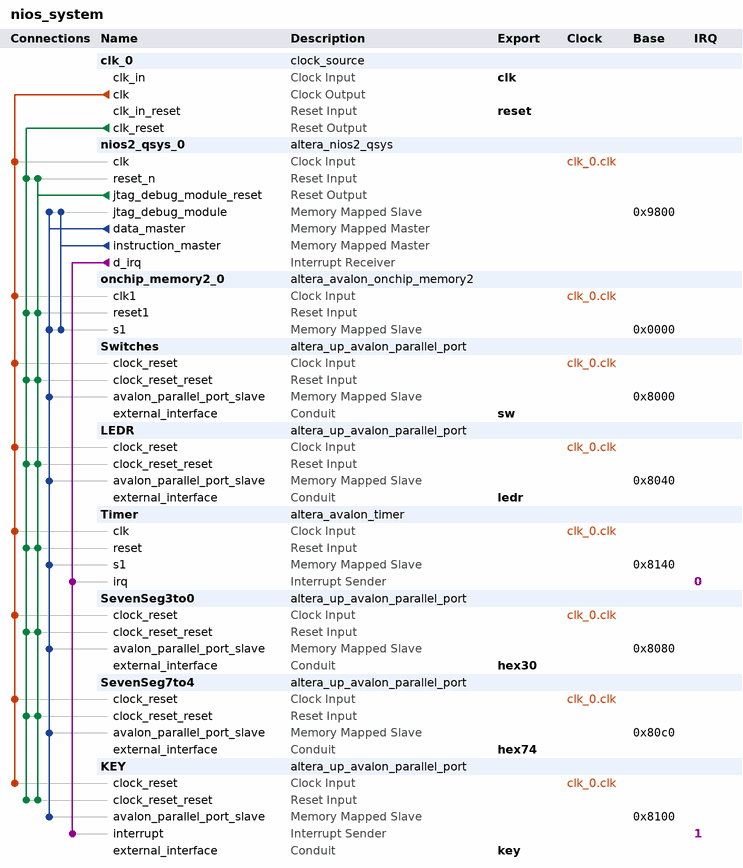
[diagram p0: system contents]
# Platform Designer (Qsys) system nios_system, Cyclone II EP2C35F672C6
# Parameters at their usual value, and those the tool derives, are not listed.
package require -exact qsys 13.0
create_system nios_system
set_project_property DEVICE_FAMILY {Cyclone II}
set_project_property DEVICE EP2C35F672C6

add_instance clk_0 clock_source 13.0
set_instance_parameter_value clk_0 clockFrequency 50000000

add_instance nios2_qsys_0 altera_nios2_qsys 13.0
set_instance_parameter_value nios2_qsys_0 resetSlave onchip_memory2_0.s1
set_instance_parameter_value nios2_qsys_0 mmu_TLBMissExcSlave None
set_instance_parameter_value nios2_qsys_0 exceptionSlave onchip_memory2_0.s1
set_instance_parameter_value nios2_qsys_0 breakSlave nios2_qsys_0.jtag_debug_module
set_instance_parameter_value nios2_qsys_0 impl Small
set_instance_parameter_value nios2_qsys_0 icache_size 4096

add_instance onchip_memory2_0 altera_avalon_onchip_memory2 13.0.1.99.2
set_instance_parameter_value onchip_memory2_0 dataWidth 32
set_instance_parameter_value onchip_memory2_0 dualPort false
set_instance_parameter_value onchip_memory2_0 initMemContent true
set_instance_parameter_value onchip_memory2_0 initializationFileName onchip_mem.hex
set_instance_parameter_value onchip_memory2_0 memorySize 32768

add_instance Switches altera_up_avalon_parallel_port 13.0
set_instance_parameter_value Switches board DE2
set_instance_parameter_value Switches preset {Slider Switches}
set_instance_parameter_value Switches capture false
set_instance_parameter_value Switches edge Rising
set_instance_parameter_value Switches irq false

add_instance LEDR altera_up_avalon_parallel_port 13.0
set_instance_parameter_value LEDR board DE2
set_instance_parameter_value LEDR preset LEDs
set_instance_parameter_value LEDR leds Red
set_instance_parameter_value LEDR capture false
set_instance_parameter_value LEDR edge Rising
set_instance_parameter_value LEDR irq false

add_instance Timer altera_avalon_timer 13.0.1.99.2
set_instance_parameter_value Timer period 1
set_instance_parameter_value Timer periodUnits MSEC

add_instance SevenSeg3to0 altera_up_avalon_parallel_port 13.0
set_instance_parameter_value SevenSeg3to0 board DE2
set_instance_parameter_value SevenSeg3to0 preset {Seven Segment Displays}
set_instance_parameter_value SevenSeg3to0 capture false
set_instance_parameter_value SevenSeg3to0 edge Rising
set_instance_parameter_value SevenSeg3to0 irq false

add_instance SevenSeg7to4 altera_up_avalon_parallel_port 13.0
set_instance_parameter_value SevenSeg7to4 board DE2
set_instance_parameter_value SevenSeg7to4 preset {Seven Segment Displays}
set_instance_parameter_value SevenSeg7to4 sevensegs {7 to 4}
set_instance_parameter_value SevenSeg7to4 capture false
set_instance_parameter_value SevenSeg7to4 edge Rising
set_instance_parameter_value SevenSeg7to4 irq false

add_instance KEY altera_up_avalon_parallel_port 13.0
set_instance_parameter_value KEY board DE2
set_instance_parameter_value KEY preset Pushbuttons
set_instance_parameter_value KEY capture true
set_instance_parameter_value KEY edge Rising
set_instance_parameter_value KEY irq true

# connections
add_connection clk_0.clk KEY.clock_reset clock
add_connection clk_0.clk LEDR.clock_reset clock
add_connection clk_0.clk nios2_qsys_0.clk clock
add_connection clk_0.clk onchip_memory2_0.clk1 clock
add_connection clk_0.clk SevenSeg3to0.clock_reset clock
add_connection clk_0.clk SevenSeg7to4.clock_reset clock
add_connection clk_0.clk Switches.clock_reset clock
add_connection clk_0.clk Timer.clk clock
add_connection clk_0.clk_reset KEY.clock_reset_reset reset
add_connection clk_0.clk_reset LEDR.clock_reset_reset reset
add_connection clk_0.clk_reset nios2_qsys_0.reset_n reset
add_connection clk_0.clk_reset onchip_memory2_0.reset1 reset
add_connection clk_0.clk_reset SevenSeg3to0.clock_reset_reset reset
add_connection clk_0.clk_reset SevenSeg7to4.clock_reset_reset reset
add_connection clk_0.clk_reset Switches.clock_reset_reset reset
add_connection clk_0.clk_reset Timer.reset reset
add_connection nios2_qsys_0.jtag_debug_module_reset KEY.clock_reset_reset reset
add_connection nios2_qsys_0.jtag_debug_module_reset LEDR.clock_reset_reset reset
add_connection nios2_qsys_0.jtag_debug_module_reset nios2_qsys_0.reset_n reset
add_connection nios2_qsys_0.jtag_debug_module_reset onchip_memory2_0.reset1 reset
add_connection nios2_qsys_0.jtag_debug_module_reset SevenSeg3to0.clock_reset_reset reset
add_connection nios2_qsys_0.jtag_debug_module_reset SevenSeg7to4.clock_reset_reset reset
add_connection nios2_qsys_0.jtag_debug_module_reset Switches.clock_reset_reset reset
add_connection nios2_qsys_0.jtag_debug_module_reset Timer.reset reset
add_connection nios2_qsys_0.data_master KEY.avalon_parallel_port_slave avalon
set_connection_parameter_value nios2_qsys_0.data_master/KEY.avalon_parallel_port_slave baseAddress 0x8100
add_connection nios2_qsys_0.data_master LEDR.avalon_parallel_port_slave avalon
set_connection_parameter_value nios2_qsys_0.data_master/LEDR.avalon_parallel_port_slave baseAddress 0x8040
add_connection nios2_qsys_0.data_master nios2_qsys_0.jtag_debug_module avalon
set_connection_parameter_value nios2_qsys_0.data_master/nios2_qsys_0.jtag_debug_module baseAddress 0x9800
add_connection nios2_qsys_0.data_master onchip_memory2_0.s1 avalon
set_connection_parameter_value nios2_qsys_0.data_master/onchip_memory2_0.s1 baseAddress 0x0000
add_connection nios2_qsys_0.data_master SevenSeg3to0.avalon_parallel_port_slave avalon
set_connection_parameter_value nios2_qsys_0.data_master/SevenSeg3to0.avalon_parallel_port_slave baseAddress 0x8080
add_connection nios2_qsys_0.data_master SevenSeg7to4.avalon_parallel_port_slave avalon
set_connection_parameter_value nios2_qsys_0.data_master/SevenSeg7to4.avalon_parallel_port_slave baseAddress 0x80c0
add_connection nios2_qsys_0.data_master Switches.avalon_parallel_port_slave avalon
set_connection_parameter_value nios2_qsys_0.data_master/Switches.avalon_parallel_port_slave baseAddress 0x8000
add_connection nios2_qsys_0.data_master Timer.s1 avalon
set_connection_parameter_value nios2_qsys_0.data_master/Timer.s1 baseAddress 0x8140
add_connection nios2_qsys_0.instruction_master nios2_qsys_0.jtag_debug_module avalon
set_connection_parameter_value nios2_qsys_0.instruction_master/nios2_qsys_0.jtag_debug_module baseAddress 0x9800
add_connection nios2_qsys_0.instruction_master onchip_memory2_0.s1 avalon
set_connection_parameter_value nios2_qsys_0.instruction_master/onchip_memory2_0.s1 baseAddress 0x0000
add_connection nios2_qsys_0.d_irq KEY.interrupt interrupt
set_connection_parameter_value nios2_qsys_0.d_irq/KEY.interrupt irqNumber 1
add_connection nios2_qsys_0.d_irq Timer.irq interrupt
set_connection_parameter_value nios2_qsys_0.d_irq/Timer.irq irqNumber 0

# exported interfaces
add_interface clk clock sink
set_interface_property clk EXPORT_OF clk_0.clk_in
add_interface reset reset sink
set_interface_property reset EXPORT_OF clk_0.clk_in_reset
add_interface sw conduit end
set_interface_property sw EXPORT_OF Switches.external_interface
add_interface ledr conduit end
set_interface_property ledr EXPORT_OF LEDR.external_interface
add_interface hex30 conduit end
set_interface_property hex30 EXPORT_OF SevenSeg3to0.external_interface
add_interface hex74 conduit end
set_interface_property hex74 EXPORT_OF SevenSeg7to4.external_interface
add_interface key conduit end
set_interface_property key EXPORT_OF KEY.external_interface

set_interconnect_requirement {$system} qsys_mm.clockCrossingAdapter HANDSHAKE
set_interconnect_requirement {$system} qsys_mm.maxAdditionalLatency 1

save_system nios_system.qsys
